# EAGLE design DoubleThumbs (EAGLE 9.1.1)
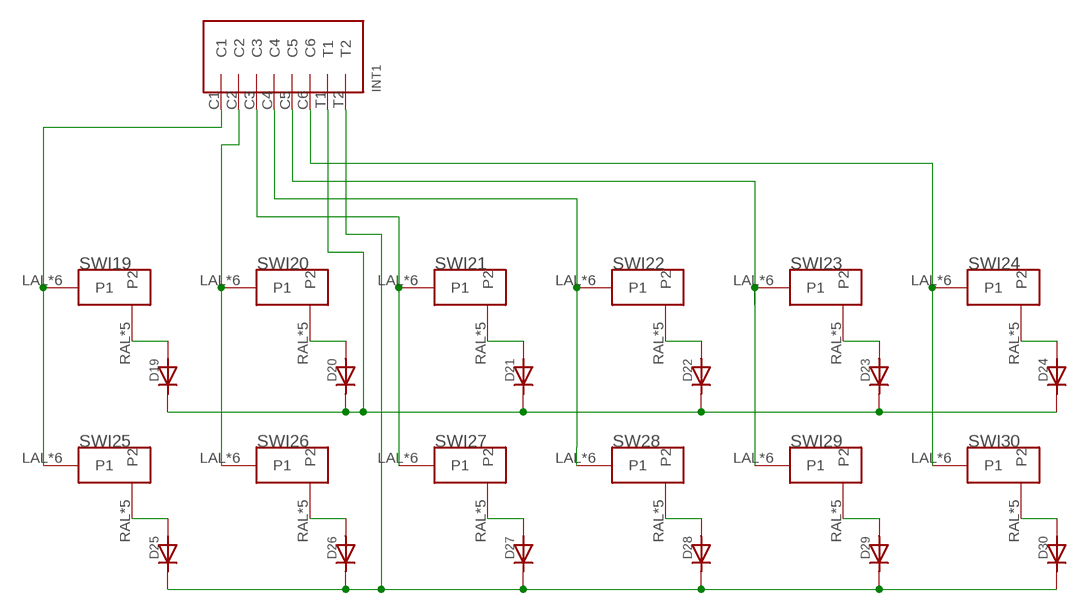
[diagram p0: schematic, sheet 1]

## Parts
D19  DIODE  [DIODE_COMBO]
D20  DIODE  [DIODE_COMBO]
D21  DIODE  [DIODE_COMBO]
D22  DIODE  [DIODE_COMBO]
D23  DIODE  [DIODE_COMBO]
D24  DIODE  [DIODE_COMBO]
D25  DIODE  [DIODE_COMBO]
D26  DIODE  [DIODE_COMBO]
D27  DIODE  [DIODE_COMBO]
D28  DIODE  [DIODE_COMBO]
D29  DIODE  [DIODE_COMBO]
D30  DIODE  [DIODE_COMBO]
INT1  INTRCNNT4X2  [INTRRIBBON]
SW28  MX/ALPSDOUBLESIDED  [DOUBLED_MX/ALPS]
SWI19  MX/ALPSDOUBLESIDED  [DOUBLED_MX/ALPS]
SWI20  MX/ALPSDOUBLESIDED  [DOUBLED_MX/ALPS]
SWI21  MX/ALPSDOUBLESIDED  [DOUBLED_MX/ALPS]
SWI22  MX/ALPSDOUBLESIDED  [DOUBLED_MX/ALPS]
SWI23  MX/ALPSDOUBLESIDED  [DOUBLED_MX/ALPS]
SWI24  MX/ALPSDOUBLESIDED  [DOUBLED_MX/ALPS]
SWI25  MX/ALPSDOUBLESIDED  [DOUBLED_MX/ALPS]
SWI26  MX/ALPSDOUBLESIDED  [DOUBLED_MX/ALPS]
SWI27  MX/ALPSDOUBLESIDED  [DOUBLED_MX/ALPS]
SWI29  MX/ALPSDOUBLESIDED  [DOUBLED_MX/ALPS]
SWI30  MX/ALPSDOUBLESIDED  [DOUBLED_MX/ALPS]

## Nets
N$1: D19.ANOSB(AN) D19.ANOST(AN) D19.ANOT(AN) SWI19.RAL(P2) SWI19.RAR(P2) SWI19.RCL(P2) SWI19.RCR(P2) SWI19.RLMID(P2)
N$2: D20.ANOSB(AN) D20.ANOST(AN) D20.ANOT(AN) SWI20.RAL(P2) SWI20.RAR(P2) SWI20.RCL(P2) SWI20.RCR(P2) SWI20.RLMID(P2)
N$3: D21.ANOSB(AN) D21.ANOST(AN) D21.ANOT(AN) SWI21.RAL(P2) SWI21.RAR(P2) SWI21.RCL(P2) SWI21.RCR(P2) SWI21.RLMID(P2)
N$4: D22.ANOSB(AN) D22.ANOST(AN) D22.ANOT(AN) SWI22.RAL(P2) SWI22.RAR(P2) SWI22.RCL(P2) SWI22.RCR(P2) SWI22.RLMID(P2)
N$5: D23.ANOSB(AN) D23.ANOST(AN) D23.ANOT(AN) SWI23.RAL(P2) SWI23.RAR(P2) SWI23.RCL(P2) SWI23.RCR(P2) SWI23.RLMID(P2)
N$6: D24.ANOSB(AN) D24.ANOST(AN) D24.ANOT(AN) SWI24.RAL(P2) SWI24.RAR(P2) SWI24.RCL(P2) SWI24.RCR(P2) SWI24.RLMID(P2)
N$7: D25.ANOSB(AN) D25.ANOST(AN) D25.ANOT(AN) SWI25.RAL(P2) SWI25.RAR(P2) SWI25.RCL(P2) SWI25.RCR(P2) SWI25.RLMID(P2)
N$8: D26.ANOSB(AN) D26.ANOST(AN) D26.ANOT(AN) SWI26.RAL(P2) SWI26.RAR(P2) SWI26.RCL(P2) SWI26.RCR(P2) SWI26.RLMID(P2)
N$9: D27.ANOSB(AN) D27.ANOST(AN) D27.ANOT(AN) SWI27.RAL(P2) SWI27.RAR(P2) SWI27.RCL(P2) SWI27.RCR(P2) SWI27.RLMID(P2)
N$10: D28.ANOSB(AN) D28.ANOST(AN) D28.ANOT(AN) SW28.RAL(P2) SW28.RAR(P2) SW28.RCL(P2) SW28.RCR(P2) SW28.RLMID(P2)
N$11: D29.ANOSB(AN) D29.ANOST(AN) D29.ANOT(AN) SWI29.RAL(P2) SWI29.RAR(P2) SWI29.RCL(P2) SWI29.RCR(P2) SWI29.RLMID(P2)
N$12: D30.ANOSB(AN) D30.ANOST(AN) D30.ANOT(AN) SWI30.RAL(P2) SWI30.RAR(P2) SWI30.RCL(P2) SWI30.RCR(P2) SWI30.RLMID(P2)
N$14: D25.CATSB(CAT) D25.CATST(CAT) D25.CATT(CAT) D26.CATSB(CAT) D26.CATST(CAT) D26.CATT(CAT) D27.CATSB(CAT) D27.CATST(CAT) D27.CATT(CAT) D28.CATSB(CAT) D28.CATST(CAT) D28.CATT(CAT) D29.CATSB(CAT) D29.CATST(CAT) D29.CATT(CAT) D30.CATSB(CAT) D30.CATST(CAT) D30.CATT(CAT) INT1.T2
N$15: INT1.C1 SWI19.LAL(P1) SWI19.LAR(P1) SWI19.LCL(P1) SWI19.LCR(P1) SWI19.LLP(P1) SWI19.LRLP(P1) SWI25.LAL(P1) SWI25.LAR(P1) SWI25.LCL(P1) SWI25.LCR(P1) SWI25.LLP(P1) SWI25.LRLP(P1)
N$16: INT1.C2 SWI20.LAL(P1) SWI20.LAR(P1) SWI20.LCL(P1) SWI20.LCR(P1) SWI20.LLP(P1) SWI20.LRLP(P1) SWI26.LAL(P1) SWI26.LAR(P1) SWI26.LCL(P1) SWI26.LCR(P1) SWI26.LLP(P1) SWI26.LRLP(P1)
N$17: INT1.C3 SWI21.LAL(P1) SWI21.LAR(P1) SWI21.LCL(P1) SWI21.LCR(P1) SWI21.LLP(P1) SWI21.LRLP(P1) SWI27.LAL(P1) SWI27.LAR(P1) SWI27.LCL(P1) SWI27.LCR(P1) SWI27.LLP(P1) SWI27.LRLP(P1)
N$18: INT1.C4 SW28.LAL(P1) SW28.LAR(P1) SW28.LCL(P1) SW28.LCR(P1) SW28.LLP(P1) SW28.LRLP(P1) SWI22.LAL(P1) SWI22.LAR(P1) SWI22.LCL(P1) SWI22.LCR(P1) SWI22.LLP(P1) SWI22.LRLP(P1)
N$19: INT1.C5 SWI23.LAL(P1) SWI23.LAR(P1) SWI23.LCL(P1) SWI23.LCR(P1) SWI23.LLP(P1) SWI23.LRLP(P1) SWI29.LAL(P1) SWI29.LAR(P1) SWI29.LCL(P1) SWI29.LCR(P1) SWI29.LLP(P1) SWI29.LRLP(P1)
N$20: INT1.C6 SWI24.LAL(P1) SWI24.LAR(P1) SWI24.LCL(P1) SWI24.LCR(P1) SWI24.LLP(P1) SWI24.LRLP(P1) SWI30.LAL(P1) SWI30.LAR(P1) SWI30.LCL(P1) SWI30.LCR(P1) SWI30.LLP(P1) SWI30.LRLP(P1)
N$21: D19.CATSB(CAT) D19.CATST(CAT) D19.CATT(CAT) D20.CATSB(CAT) D20.CATST(CAT) D20.CATT(CAT) D21.CATSB(CAT) D21.CATST(CAT) D21.CATT(CAT) D22.CATSB(CAT) D22.CATST(CAT) D22.CATT(CAT) D23.CATSB(CAT) D23.CATST(CAT) D23.CATT(CAT) D24.CATSB(CAT) D24.CATST(CAT) D24.CATT(CAT) INT1.T1

## Library data of the parts
D19-D30 = Keys:DIODE
INT1 = Keys:INTRCNNT
SW28 SWI19-SWI27 SWI29 SWI30 = Keys:MX/ALPS

## Board
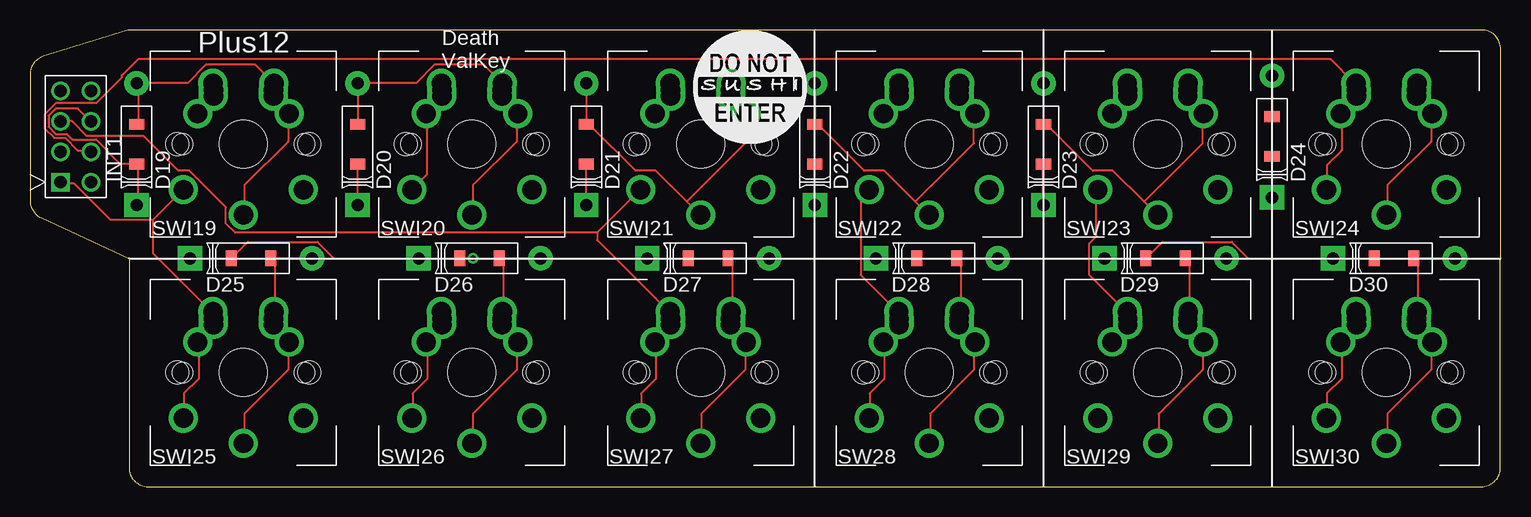
[diagram p1: board, top side]
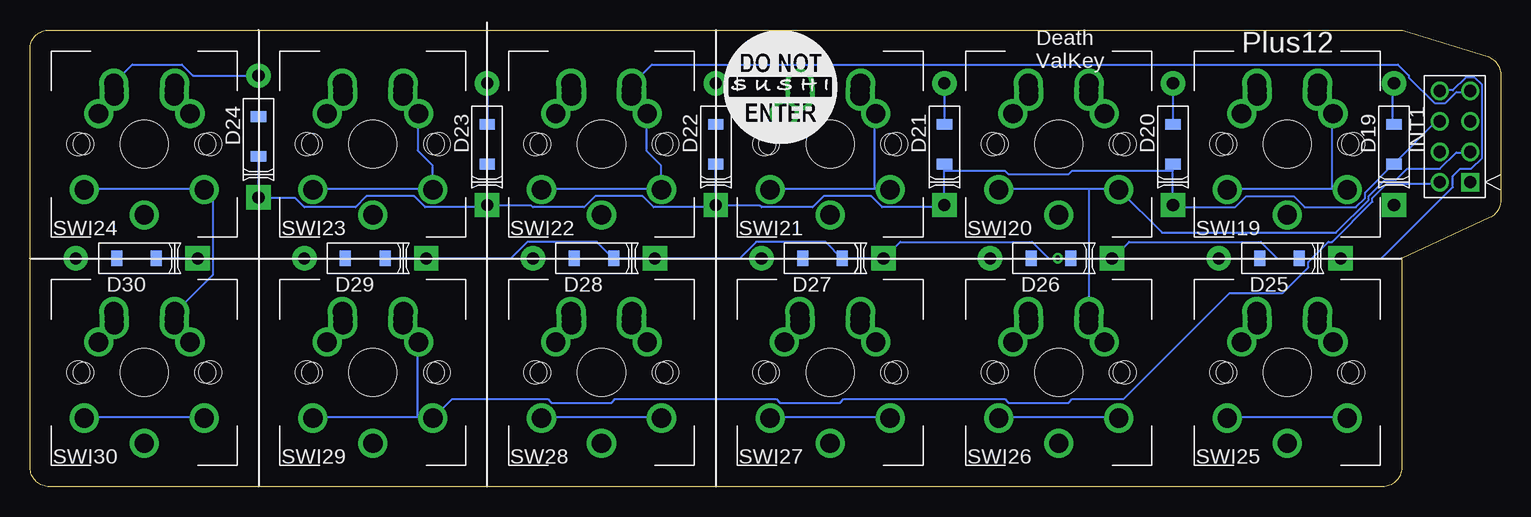
[diagram p2: board, bottom side, seen from below]

Size 122.55 x 38.1 mm. Coordinates in mm from the lower left corner, seen from the top.
Outline: 8.26,19.05 8.26,1.59 arc90 9.84,0 120.95,0 arc90 122.54,1.59 122.55,36.51 arc90 120.97,38.1 8.49,38.1 arc17 8.03,38.03 1.12,35.91 arc73 0,34.39 0,23.88 arc65 0.92,22.43 8.26,19.05
Copper layers (1*16): Top 0.035mm / dielectric 1.5mm / Bottom 0.035mm
Design rules "Sierra": minimum track width 6mil, minimum drill 0.45mm, track to track 6mil, track to pad 6mil, pad to pad 6mil, via to via 6mil, smd to smd 6mil, copper to edge 0.4mm, drill to drill 10mil, minimum pad ring 10mil, minimum via ring 8mil, stop-mask expansion 4mil, vias tented up to drill 0mil, thermal gap 10mil

### Footprints (pad centres in the part's own frame; a part is rotated, then mirrored left to right if it is on the bottom)
DIODE_COMBO = smd 0.914 x 1.27 bottom: ANOSB 1.651,0; CATSB -1.651,0 | smd 0.914 x 1.27: ANOST 1.651,0; CATST -1.651,0 | drill 1.016 pad 2.032: ANOT 5.08,0 | drill 1.016 pad 2.032 square: CATT -5.08,0
INTRRIBBON = drill 1.016 square: C1 0,0 | drill 1.016: C2 2.54,0; C3 5.08,0; C4 7.62,0; C5 0,-2.54; C6 2.54,-2.54; T1 5.08,-2.54; T2 7.62,-2.54
DOUBLED_MX/ALPS = drill 1.613: LAL -2.5,4; LAR -2.5,4.5; LCL -3.81,2.54; LCR -2.54,5.08; LLP -5,-3.8; LRLP 5,-3.8; RAL 2.5,4; RAR 2.5,4.5; RCL 3.81,2.54; RCR 2.54,5.08; RLMID 0,-5.9 | hole 3.988: 0,0 | hole 1.702: -5.08,0; 5.08,0 | hole 1.9: -5.5,0; 5.5,0

### Placement (x,y rotation side)
D19  8.89,28.57 90 top
D20  27.3,28.57 90 top
D21  46.36,28.57 90 top
D22  65.41,28.57 90 top
D23  84.45,28.57 90 top
D24  103.5,29.21 90 top
D25  18.41,19.05 0 top
D26  37.47,19.05 0 top
D27  56.52,19.05 0 top
D28  75.56,19.05 0 top
D29  94.61,19.05 0 top
D30  113.66,19.05 0 top
INT1  2.54,25.4 90 top
SW28  74.93,9.53 0 top
SWI19  17.78,28.57 0 top
SWI20  36.83,28.57 0 top
SWI21  55.88,28.57 0 top
SWI22  74.93,28.57 0 top
SWI23  93.98,28.57 0 top
SWI24  113.03,28.57 0 top
SWI25  17.78,9.53 0 top
SWI26  36.83,9.53 0 top
SWI27  55.88,9.53 0 top
SWI29  93.98,9.53 0 top
SWI30  113.03,9.53 0 top
U$1  [3_8INCH_BOT]  55.25,28.57 0 top
U$2  [3_8INCH_TOP]  55.25,28.57 0 top

### Tracks (layer width: path | path; a pad name or v marks a point on that pad's centre or on a via)
N$1
  Top 0.152: D19.ANOST 9.02,30.33 9.02,33.53 D19.ANOT 9.02,33.68 13.13,33.68 14.66,35.2 18.77,35.2 20.3,33.68 | 20.3,33.68 SWI19.RAL SWI19.RAR 20.3,33.68 | 20.3,33.68 SWI19.RCR 20.3,32.46 21.51,31.24 SWI19.RCL 21.51,31.09 21.51,28.8 17.86,25.15 17.86,22.71 SWI19.RLMID
  Bottom 0.152: D19.ANOST 9.02,30.33 9.02,33.53 D19.ANOT
N$2
  Top 0.152: SWI20.RLMID 36.91,22.71 36.91,25.15 40.56,28.8 40.56,31.09 SWI20.RCL 40.56,31.24 39.34,32.46 SWI20.RCR 39.34,33.68 | D20.ANOST 27.3,30.33 27.3,33.53 D20.ANOT 27.3,33.68 32.18,33.68 33.71,35.2 37.82,35.2 39.34,33.68 | 39.34,33.68 SWI20.RAL 39.34,33.07 SWI20.RAR 39.34,33.68
  Bottom 0.152: D20.ANOST 27.3,30.33 27.3,33.53 D20.ANOT
N$3
  Top 0.152: 58.4,33.07 58.4,32.61 SWI21.RAL | 58.4,33.07 SWI21.RCR | SWI21.RAL 58.4,32.46 59.61,31.24 SWI21.RCL 59.61,31.09 59.61,28.65 54.74,23.77 | 58.4,33.07 SWI21.RAR | 58.4,33.07 SWI21.RAL | D21.ANOT 46.36,33.53 46.36,30.33 D21.ANOST 46.36,30.18 46.66,30.18 50.47,26.36 52.15,26.36 54.74,23.77 | 54.74,23.77 55.8,22.71 SWI21.RLMID
  Bottom 0.152: D21.ANOST 46.36,30.33 46.36,33.53 D21.ANOT
N$4
  Top 0.152: SWI22.RAL 77.44,32.61 77.44,33.07 SWI22.RAR | SWI22.RAL 77.44,32.46 78.66,31.24 SWI22.RCL 78.66,31.09 78.66,28.65 73.79,23.77 | SWI22.RCR 77.44,33.53 77.44,33.22 SWI22.RAL | D22.ANOT 65.41,33.53 65.41,30.33 D22.ANOST 65.41,30.18 65.71,30.18 69.52,26.36 71.2,26.36 73.79,23.77 | 73.79,23.77 74.85,22.71 SWI22.RLMID
  Bottom 0.152: D22.ANOST 65.41,30.33 65.41,33.53 D22.ANOT
N$5
  Top 0.152: 96.49,33.07 96.49,32.61 SWI23.RAL | 96.49,33.07 SWI23.RCR | SWI23.RAL 96.49,32.46 97.71,31.24 SWI23.RCL 97.71,31.09 97.71,28.65 92.84,23.77 | 96.49,33.07 SWI23.RAR | 96.49,33.07 SWI23.RAL | D23.ANOT 84.45,33.53 84.45,30.33 D23.ANOST 84.45,30.18 84.76,30.18 88.57,26.36 90.25,26.36 92.84,23.77 | 92.84,23.77 93.9,22.71 SWI23.RLMID
  Bottom 0.152: D23.ANOST 84.45,30.33 84.45,33.53 D23.ANOT
N$6
  Top 0.152: SWI24.RLMID 113.11,22.71 113.11,25.15 116.76,28.8 116.76,31.09 SWI24.RCL 116.76,31.24 115.55,32.46 SWI24.RCR | D24.ANOT 103.5,30.94 D24.ANOST
  Bottom 0.152: D24.ANOST 103.5,30.94 D24.ANOT 108.99,34.29 109.91,35.2 114.02,35.2 115.55,33.68 | 115.55,33.68 SWI24.RAL SWI24.RAR 115.55,33.68 | 115.55,33.68 SWI24.RCR
N$7
  Top 0.152: D25.ANOT 20.45,19.05 | 20.45,19.05 20.14,19.05 D25.ANOST 20.45,19.05 | 20.45,19.05 20.45,14.63 SWI25.RCR SWI25.RAR | SWI25.RAR 20.3,13.56 SWI25.RAL SWI25.RAR | SWI25.RAR 20.3,13.41 21.51,12.19 SWI25.RCL 21.51,12.04 21.51,9.75 17.86,6.1 17.86,3.66 SWI25.RLMID
  Bottom 0.152: D25.ANOT 20.14,19.05 D25.ANOST
N$8
  Top 0.152: D26.ANOT 39.5,19.05 | 39.5,19.05 39.19,19.05 D26.ANOST 39.5,19.05 | 39.5,19.05 39.5,14.63 SWI26.RCR 39.34,14.02 | 39.34,14.02 39.34,13.56 SWI26.RAL 39.34,14.02 | 39.34,14.02 SWI26.RAR 39.34,13.41 40.56,12.19 SWI26.RCL 40.56,12.04 40.56,9.75 36.91,6.1 36.91,3.66 SWI26.RLMID
  Bottom 0.152: D26.ANOT 39.19,19.05 D26.ANOST
N$9
  Top 0.152: D27.ANOT 58.55,19.05 | 58.55,19.05 58.24,19.05 D27.ANOST 58.55,19.05 | 58.55,19.05 58.55,14.63 SWI27.RCR 58.4,14.02 | 58.4,14.02 58.4,13.56 SWI27.RAL 58.4,14.02 | 58.4,14.02 SWI27.RAR 58.4,13.41 59.61,12.19 SWI27.RCL 59.61,12.04 59.61,9.75 55.96,6.1 55.96,3.66 SWI27.RLMID
  Bottom 0.152: D27.ANOT 58.24,19.05 D27.ANOST
N$10
  Top 0.152: D28.ANOT 77.6,19.05 | 77.6,19.05 77.29,19.05 D28.ANOST 77.6,19.05 | 77.6,19.05 77.6,14.63 SW28.RCR 77.44,14.02 | 77.44,14.02 77.44,13.56 SW28.RAL 77.44,14.02 | 77.44,14.02 SW28.RAR 77.44,13.41 78.66,12.19 SW28.RCL 78.66,12.04 78.66,9.75 75.01,6.1 75.01,3.66 SW28.RLMID
  Bottom 0.152: D28.ANOT 77.29,19.05 D28.ANOST
N$11
  Top 0.152: D29.ANOT 96.65,19.05 | 96.65,19.05 96.34,19.05 D29.ANOST 96.65,19.05 | 96.65,19.05 96.65,14.63 SWI29.RCR 96.49,14.02 | 96.49,14.02 96.49,13.56 SWI29.RAL 96.49,14.02 | 96.49,14.02 SWI29.RAR 96.49,13.41 97.71,12.19 SWI29.RCL 97.71,12.04 97.71,9.75 94.06,6.1 94.06,3.66 SWI29.RLMID
  Bottom 0.152: D29.ANOT 96.34,19.05 D29.ANOST
N$12
  Top 0.152: D30.ANOT 115.7,19.05 | 115.7,19.05 115.39,19.05 D30.ANOST 115.7,19.05 | 115.7,19.05 115.7,14.63 SWI30.RCR SWI30.RAR | SWI30.RAR 115.55,13.56 SWI30.RAL SWI30.RAR | SWI30.RAR 115.55,13.41 116.76,12.19 SWI30.RCL 116.76,12.04 116.76,9.75 113.11,6.1 113.11,3.66 SWI30.RLMID
  Bottom 0.152: D30.ANOT 115.39,19.05 D30.ANOST
N$14  (via drill 0.45)
  Top 0.152: D25.CATT 13.44,19.05 16.64,19.05 D25.CATST 16.79,19.05 18.16,20.42 23.95,20.42 25.32,19.05 32.33,19.05 D26.CATT 32.49,19.05 35.69,19.05 D26.CATST 35.84,19.05 v36.91,19.05 | D30.CATST 111.89,19.05 108.69,19.05 D30.CATT 108.53,19.05 101.52,19.05 100.15,20.42 94.36,20.42 92.99,19.05 D29.CATST 92.84,19.05 89.64,19.05 D29.CATT | D28.CATST 73.79,19.05 70.59,19.05 D28.CATT | D27.CATST 54.74,19.05 51.54,19.05 D27.CATT
  Bottom 0.152: D25.CATST 16.79,19.05 18.62,19.05 19.99,20.42 30.96,20.42 32.33,19.05 D26.CATT | INT1.T2 5.06,33.07 3.99,33.07 2.92,34.14 2.16,34.14 1.55,33.53 1.55,27.43 2.46,26.52 3.38,26.52 3.99,25.91 3.99,24.99 9.93,19.05 13.28,19.05 D25.CATT | D30.CATST 111.89,19.05 108.69,19.05 D30.CATT | D29.CATST 92.84,19.05 89.64,19.05 D29.CATT 89.48,19.05 82.47,19.05 81.1,20.42 75.31,20.42 73.94,19.05 D28.CATST 73.79,19.05 70.59,19.05 D28.CATT 70.43,19.05 63.42,19.05 62.05,20.42 56.26,20.42 54.89,19.05 D27.CATST 54.74,19.05 51.54,19.05 D27.CATT 51.38,19.05 50.01,20.42 39.04,20.42 37.67,19.05 v36.91,19.05 35.84,19.05 D26.CATST
N$15
  Top 0.152: SWI25.LAR 15.42,14.02 15.42,13.56 SWI25.LAL 15.27,14.17 15.27,14.48 SWI25.LCR | SWI25.LLP 12.83,5.79 12.83,7.77 14.05,8.99 14.05,12.04 SWI25.LCL 14.05,12.19 15.27,13.41 SWI25.LCR | SWI19.LCL 14.05,31.24 15.27,32.46 SWI19.LAL 15.27,33.22 15.27,33.53 SWI19.LCR 15.27,33.07 SWI19.LAR | 10.24,22.25 6.73,22.25 3.68,25.3 2.62,25.3 INT1.C1 | 10.24,22.25 12.68,24.69 SWI19.LLP | 10.24,22.25 10.24,19.51 15.11,14.63 SWI25.LCR
  Bottom 0.152: SWI25.LRLP 22.73,5.79 12.83,5.79 SWI25.LLP | 14.05,24.84 12.83,24.84 SWI19.LLP | 14.05,24.84 22.73,24.84 SWI19.LRLP | 14.05,24.84 14.05,31.09 SWI19.LCL
N$16
  Top 0.152: 34.47,14.02 34.47,13.56 SWI26.LAL 34.47,14.02 | 34.47,14.02 SWI26.LCR | 34.47,14.02 SWI26.LAR 34.31,13.41 33.1,12.19 SWI26.LCL 33.1,12.04 33.1,8.99 31.88,7.77 31.88,5.79 SWI26.LLP | SWI20.LAR SWI20.LCR 34.31,33.53 34.31,33.22 SWI20.LAL 34.31,32.46 33.1,31.24 SWI20.LCL 33.1,31.09 33.1,26.06 31.88,24.84 SWI20.LLP
  Bottom 0.152: SWI26.LRLP 41.78,5.79 31.88,5.79 SWI26.LLP | INT1.C2 2.62,27.89 3.68,27.89 5.06,26.52 7.8,26.52 8.71,25.6 9.63,25.6 11,24.23 11,23.93 13.74,21.18 28.22,21.18 31.73,24.69 SWI20.LLP 31.88,24.84 34.31,24.84 | 34.31,24.84 41.78,24.84 SWI20.LRLP | 34.31,24.84 34.31,14.63 SWI26.LAR
N$17
  Top 0.152: SWI27.LAR 53.52,14.02 53.52,13.56 SWI27.LAL 53.37,14.17 53.37,14.48 SWI27.LCR | SWI27.LLP 50.93,5.79 50.93,7.77 52.15,8.99 52.15,12.04 SWI27.LCL 52.15,12.19 53.37,13.41 SWI27.LCR | SWI21.LCL 52.15,31.24 53.37,32.46 SWI21.LCR 53.37,32.61 SWI21.LAL SWI21.LAR | 47.27,21.18 17.09,21.18 16.33,21.95 16.33,23.32 13.28,26.36 12.37,26.36 9.47,29.26 4.75,29.26 3.53,30.48 2.62,30.48 INT1.C3 | 47.27,21.18 50.78,24.69 SWI21.LLP | 47.27,21.18 47.27,20.57 53.21,14.63 SWI27.LCR
  Bottom 0.152: SWI27.LRLP 60.83,5.79 50.93,5.79 SWI27.LLP | 52.15,24.84 50.93,24.84 SWI21.LLP | 52.15,24.84 60.83,24.84 SWI21.LRLP | 52.15,24.84 52.15,31.09 SWI21.LCL
N$18
  Top 0.152: SW28.LAR 72.57,14.02 72.57,13.56 SW28.LAL 72.41,14.17 72.41,14.48 SW28.LCR | SW28.LLP 69.98,5.79 69.98,7.77 71.2,8.99 71.2,12.04 SW28.LCL 71.2,12.19 72.41,13.41 SW28.LCR | 72.57,33.07 72.57,32.61 SWI22.LAL 72.57,33.07 | 72.57,33.07 SWI22.LCR | 72.57,33.07 SWI22.LAR 72.41,32.46 71.2,31.24 SWI22.LCL | SW28.LCR 72.26,14.63 69.22,17.68 69.22,24.08 69.83,24.69 SWI22.LLP
  Bottom 0.152: SW28.LRLP 79.88,5.79 69.98,5.79 SW28.LLP | 69.98,24.84 69.98,26.82 71.2,28.04 71.2,31.09 SWI22.LCL | 69.98,24.84 SWI22.LLP 69.98,24.84 | 69.98,24.84 79.88,24.84 SWI22.LRLP | INT1.C4 2.62,32.92 3.68,32.92 4.6,32 5.51,32 7.65,34.14 7.65,34.29 8.56,35.2 70.74,35.2 72.26,33.68 SWI22.LCR
N$19
  Top 0.152: SWI23.LAR 91.62,33.07 91.62,32.61 SWI23.LAL 91.46,33.22 91.46,33.53 SWI23.LCR 91.46,32.46 90.25,31.24 SWI23.LCL | SWI29.LCL 90.25,12.19 91.46,13.41 SWI29.LAR 91.46,13.56 SWI29.LAL 91.46,14.17 91.46,14.48 SWI29.LCR 91.31,14.63 88.27,17.68 88.27,20.27 88.88,20.88 88.88,24.69 SWI23.LLP
  Bottom 0.152: 89.03,24.84 89.03,26.82 90.25,28.04 90.25,31.09 SWI23.LCL | 89.03,24.84 SWI23.LLP 89.03,24.84 | 89.03,24.84 98.93,24.84 SWI23.LRLP | INT1.C5 5.21,25.3 9.47,25.3 10.69,24.08 10.69,23.77 14.05,20.42 14.35,20.42 16.03,18.75 16.03,18.29 18.16,16.15 22.58,16.15 31.42,7.32 35.69,7.32 35.99,7.01 41.02,7.01 41.33,7.32 54.74,7.32 55.04,7.01 60.07,7.01 60.38,7.32 73.79,7.32 74.09,7.01 79.12,7.01 79.43,7.32 87.35,7.32 88.88,5.79 SWI29.LLP 89.03,5.79 90.25,5.79 | 90.25,5.79 98.93,5.79 SWI29.LRLP | 90.25,5.79 90.25,12.04 SWI29.LCL
N$20
  Top 0.152: SWI30.LAR 110.52,14.17 110.52,14.48 SWI30.LCR 110.67,14.02 110.67,13.56 SWI30.LAL 110.52,13.41 109.3,12.19 SWI30.LCL 109.3,12.04 109.3,8.99 108.08,7.77 108.08,5.79 SWI30.LLP | SWI24.LLP 108.08,24.84 108.08,26.82 109.3,28.04 109.3,31.09 SWI24.LCL 109.3,31.24 110.52,32.46 SWI24.LAL 110.67,32.61 110.67,33.07 SWI24.LCR 110.36,33.68 | 110.36,33.68 108.38,35.66 9.02,35.66 7.65,34.29 7.65,34.14 5.51,32 2.16,32 1.25,31.09 1.25,29.87 2.01,29.11 2.92,29.11 3.99,28.04 5.06,28.04 INT1.C6 | 110.36,33.68 SWI24.LAR 110.36,33.68
  Bottom 0.152: SWI30.LRLP 117.98,5.79 108.08,5.79 SWI30.LLP | SWI24.LRLP 117.98,24.84 108.08,24.84 SWI24.LLP 107.92,24.69 107.31,24.08 107.31,17.68 110.36,14.63 SWI30.LAL
N$21
  Top 0.152: D19.CATT 9.02,23.62 9.02,26.82 D19.CATST 8.87,26.98 7.49,26.98 5.51,28.96 3.53,28.96 3.07,29.41 2.16,29.41 1.55,30.02 1.55,30.94 2.16,31.55 3.99,31.55 5.06,30.48 INT1.T1 | D24.CATST 103.5,27.43 103.5,24.23 D24.CATT | D23.CATST 84.45,26.82 84.45,23.62 D23.CATT | D22.CATST 65.41,26.82 65.41,23.62 D22.CATT | D20.CATST 27.3,26.82 27.3,23.62 D20.CATT | D21.CATST 46.36,26.82 46.36,23.62 D21.CATT
  Bottom 0.152: INT1.T1 5.21,30.48 5.36,30.48 8.87,26.98 D19.CATST 9.02,26.82 11.3,24.54 11.3,24.08 12.07,23.32 16.33,23.32 17.25,24.23 21.21,24.23 22.12,23.32 27.15,23.32 27.3,23.47 D20.CATT 27.3,23.62 27.3,26.36 | D24.CATST 103.5,27.43 103.5,24.23 D24.CATT 103.5,24.08 100.46,24.08 99.69,23.32 95.43,23.32 94.51,24.23 90.55,24.23 89.64,23.32 84.61,23.32 84.45,23.47 | D23.CATST 84.45,26.82 84.45,23.62 D23.CATT | D22.CATST 65.41,26.82 65.41,23.62 D22.CATT | 27.3,26.36 27.3,26.82 D20.CATST | 46.36,26.36 46.36,23.62 D21.CATT 46.36,23.47 46.51,23.32 51.54,23.32 52.45,24.23 56.41,24.23 57.33,23.32 61.6,23.32 61.75,23.47 65.41,23.47 | 46.36,26.36 46.36,26.82 D21.CATST | 27.3,26.36 35.69,26.36 35.99,26.06 41.02,26.06 41.33,26.36 46.36,26.36 | 65.41,23.47 D22.CATT | 84.45,23.47 80.8,23.47 80.64,23.32 76.38,23.32 75.46,24.23 71.5,24.23 70.59,23.32 65.56,23.32 65.41,23.47 | 84.45,23.47 D23.CATT | 65.41,23.47 D22.CATT | 84.45,23.47 D23.CATT

### Text on the board
tPlace: Plus12 | Death / ValKey
bPlace: Plus12 | Death / ValKey